# EAGLE schematic MainCirctuit (EAGLE 7.4.0)
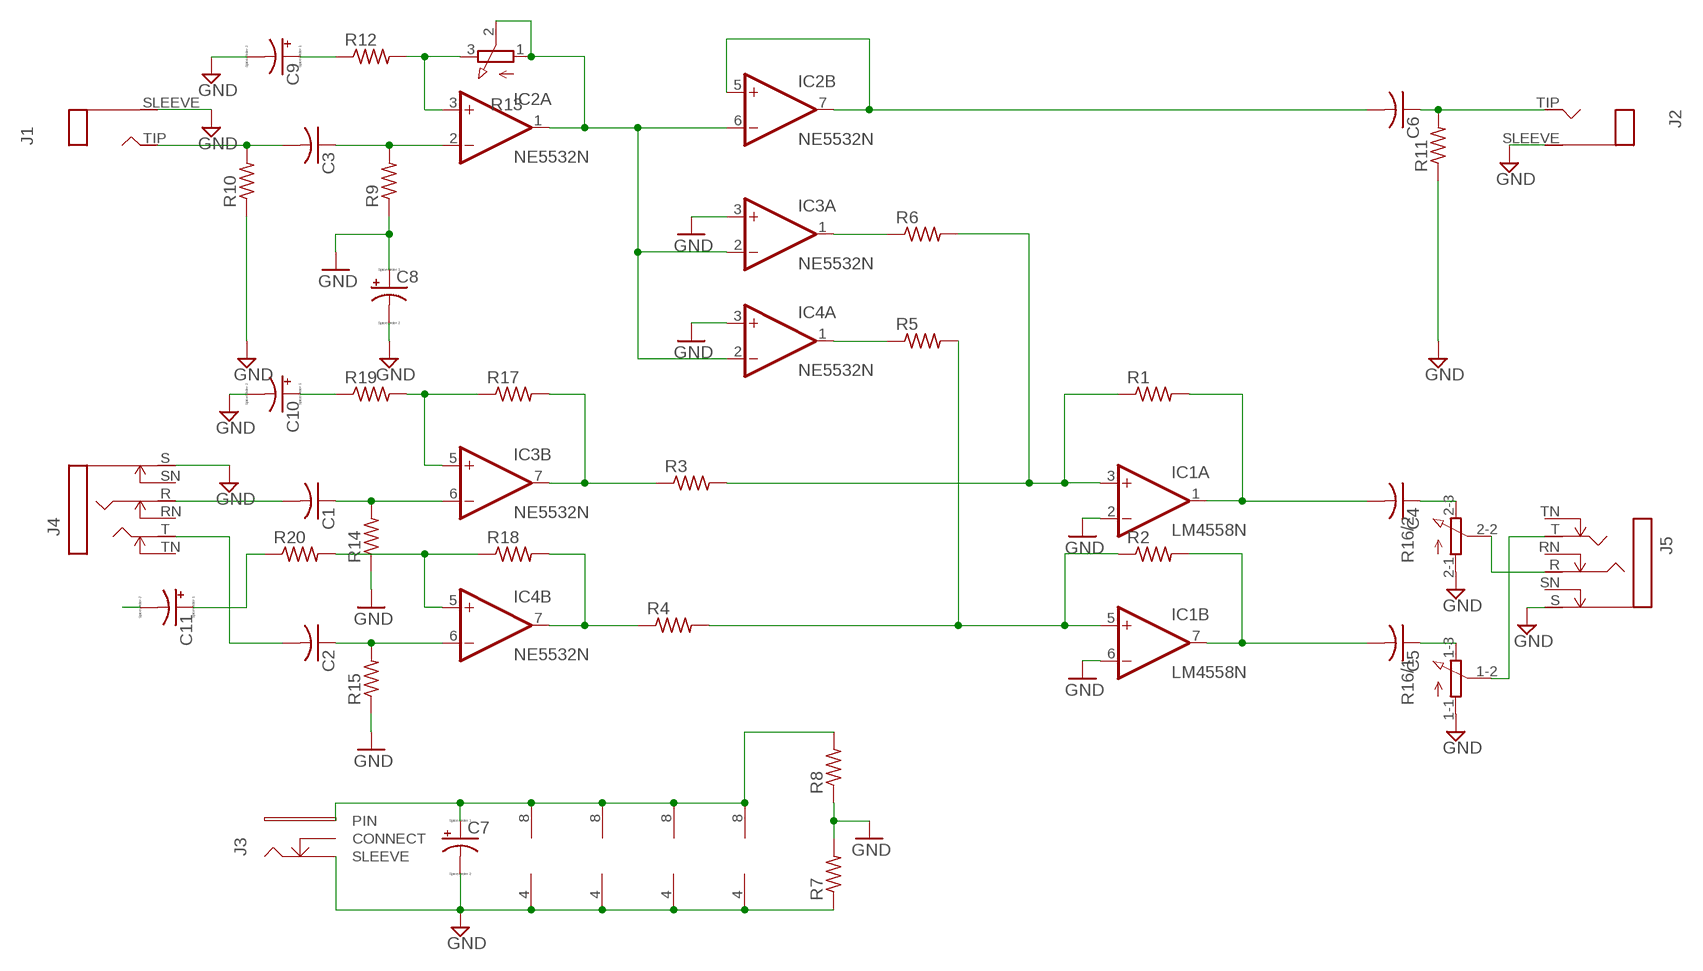
[diagram p0: schematic, sheet 1]

## Parts
C1  C-US050-025X075  [C050-025X075]
C2  C-US050-025X075  [C050-025X075]
C3  C-US050-025X075  [C050-025X075]
C4  C-US050-025X075  [C050-025X075]
C5  C-US050-025X075  [C050-025X075]
C6  C-US050-025X075  [C050-025X075]
C7  CPOL-USE2,5-6E  [E2,5-6E]
C8  CPOL-USE2,5-6E  [E2,5-6E]
C9  CPOL-USE2,5-6E  [E2,5-6E]
C10  CPOL-USE2,5-6E  [E2,5-6E]
C11  CPOL-USE2,5-6E  [E2,5-6E]
IC1  LM4558N  [DIL08]
IC2  NE5532N  [DIL08]
IC3  NE5532N  [DIL08]
IC4  NE5532N  [DIL08]
J1  MONOA  [MONO_JACK_A]
J2  MONOA  [MONO_JACK_A]
J3  DC  [DC_POWER_JACK]
J4  STEREOSW  [NMJ6HCD2]
J5  STEREOSW  [NMJ6HCD2]
R1  R-US_0204/7  [0204/7]
R2  R-US_0204/7  [0204/7]
R3  R-US_0204/7  [0204/7]
R4  R-US_0204/7  [0204/7]
R5  R-US_0204/7  [0204/7]
R6  R-US_0204/7  [0204/7]
R7  R-US_0204/7  [0204/7]
R8  R-US_0204/7  [0204/7]
R9  R-US_0204/7  [0204/7]
R10  R-US_0204/7  [0204/7]
R11  R-US_0204/7  [0204/7]
R12  R-US_0204/7  [0204/7]
R13  3RP/1610N  [3RP/1610N]
R14  R-US_0204/7  [0204/7]
R15  R-US_0204/7  [0204/7]
R16  3RP/1610G  [3RP/1610G]
R17  R-US_0204/7  [0204/7]
R18  R-US_0204/7  [0204/7]
R19  R-US_0204/7  [0204/7]
R20  R-US_0204/7  [0204/7]

## Nets
GND: C7.- C8.+ C8.- C9.- C10.- IC1.2(A:-IN) IC1.4(P:V-) IC1.6(B:-IN) IC2.4(P:V-) IC3.3(A:+IN) IC3.4(P:V-) IC4.3(A:+IN) IC4.4(P:V-) J1.SLEEVE J2.SLEEVE J3.SLEEVE J4.S J5.S R7.1 R7.2 R8.1 R9.1 R10.1 R11.1 R14.1 R15.1 R16.1-1(/1:A) R16.2-1(/2:A)
N$1: IC3.7(B:OUT) R3.1 R17.2
N$2: IC4.7(B:OUT) R4.1 R18.2
N$3: IC4.1(A:OUT) R5.1
N$4: J5.T R16.1-2(/1:S)
N$5: IC1.5(B:+IN) R2.1 R4.2 R5.2
N$6: IC1.3(A:+IN) R1.1 R3.2 R6.2
N$7: C4.2 IC1.1(A:OUT) R1.2
N$8: C2.2 J4.T
N$9: C1.2 J4.R
N$10: C1.1 IC3.6(B:-IN) R14.2
N$11: IC3.1(A:OUT) R6.1
N$12: C2.1 IC4.6(B:-IN) R15.2
N$13: C5.2 IC1.7(B:OUT) R2.2
N$14: J5.R R16.2-2(/2:S)
N$15: IC2.1(A:OUT) IC2.6(B:-IN) IC3.2(A:-IN) IC4.2(A:-IN) R13.1(A) R13.2(S)
N$16: C6.2 IC2.5(B:+IN) IC2.7(B:OUT)
N$17: C3.2 J1.TIP R10.2
N$18: C3.1 IC2.2(A:-IN) R9.2
N$19: C6.1 J2.TIP R11.2
N$20: C7.+ IC1.8(P:V+) IC2.8(P:V+) IC3.8(P:V+) IC4.8(P:V+) J3.PIN R8.2
N$21: C9.+ R12.1
N$22: IC2.3(A:+IN) R12.2 R13.3(E)
N$23: C4.1 R16.2-3(/2:E)
N$24: C5.1 R16.1-3(/1:E)
N$25: IC4.5(B:+IN) R18.1 R20.2
N$26: IC3.5(B:+IN) R17.1 R19.2
N$27: C10.+ R19.1
N$28: C11.+ R20.1
N$29: C11.-
Unconnected: J3.CLOSE(CONNECT) J4.RN J4.SN J4.TN J5.RN J5.SN J5.TN

## Library data of the parts
C1-C6 = resistor:C-US: CAPACITOR, American symbol
C7-C11 = resistor:CPOL-US: POLARIZED CAPACITOR, American symbol
IC1 = gm-ics:*4558: *4558 Op Amp Infamous for its use in tube screamers. This op amp has many manufacturers, hence the leading "*" in the name. The JRC4558 is a widely used example.
IC2-IC4 = linear:NE5532: AUDIO AMPLIFIER
J1 J2 = gm-jacks:MONO: Mono 1/4" Phone Jack
J3 = gm-jacks:DC: DC Jack
J4 J5 = gm-jacks:STEREOSW
R1-R12 R14 R15 R17-R20 = resistor:R-US_: RESISTOR, American symbol
R13 = pot:3RP/1610N: 16mm Potentiometer one level Source: http://www.alphapotentiometers.net/html/16mm_pot_2.html
R16 = pot:3RP/1610G: 16mm Potentiometer two level Source: http://www.alphapotentiometers.net/html/16mm_pot_2.html